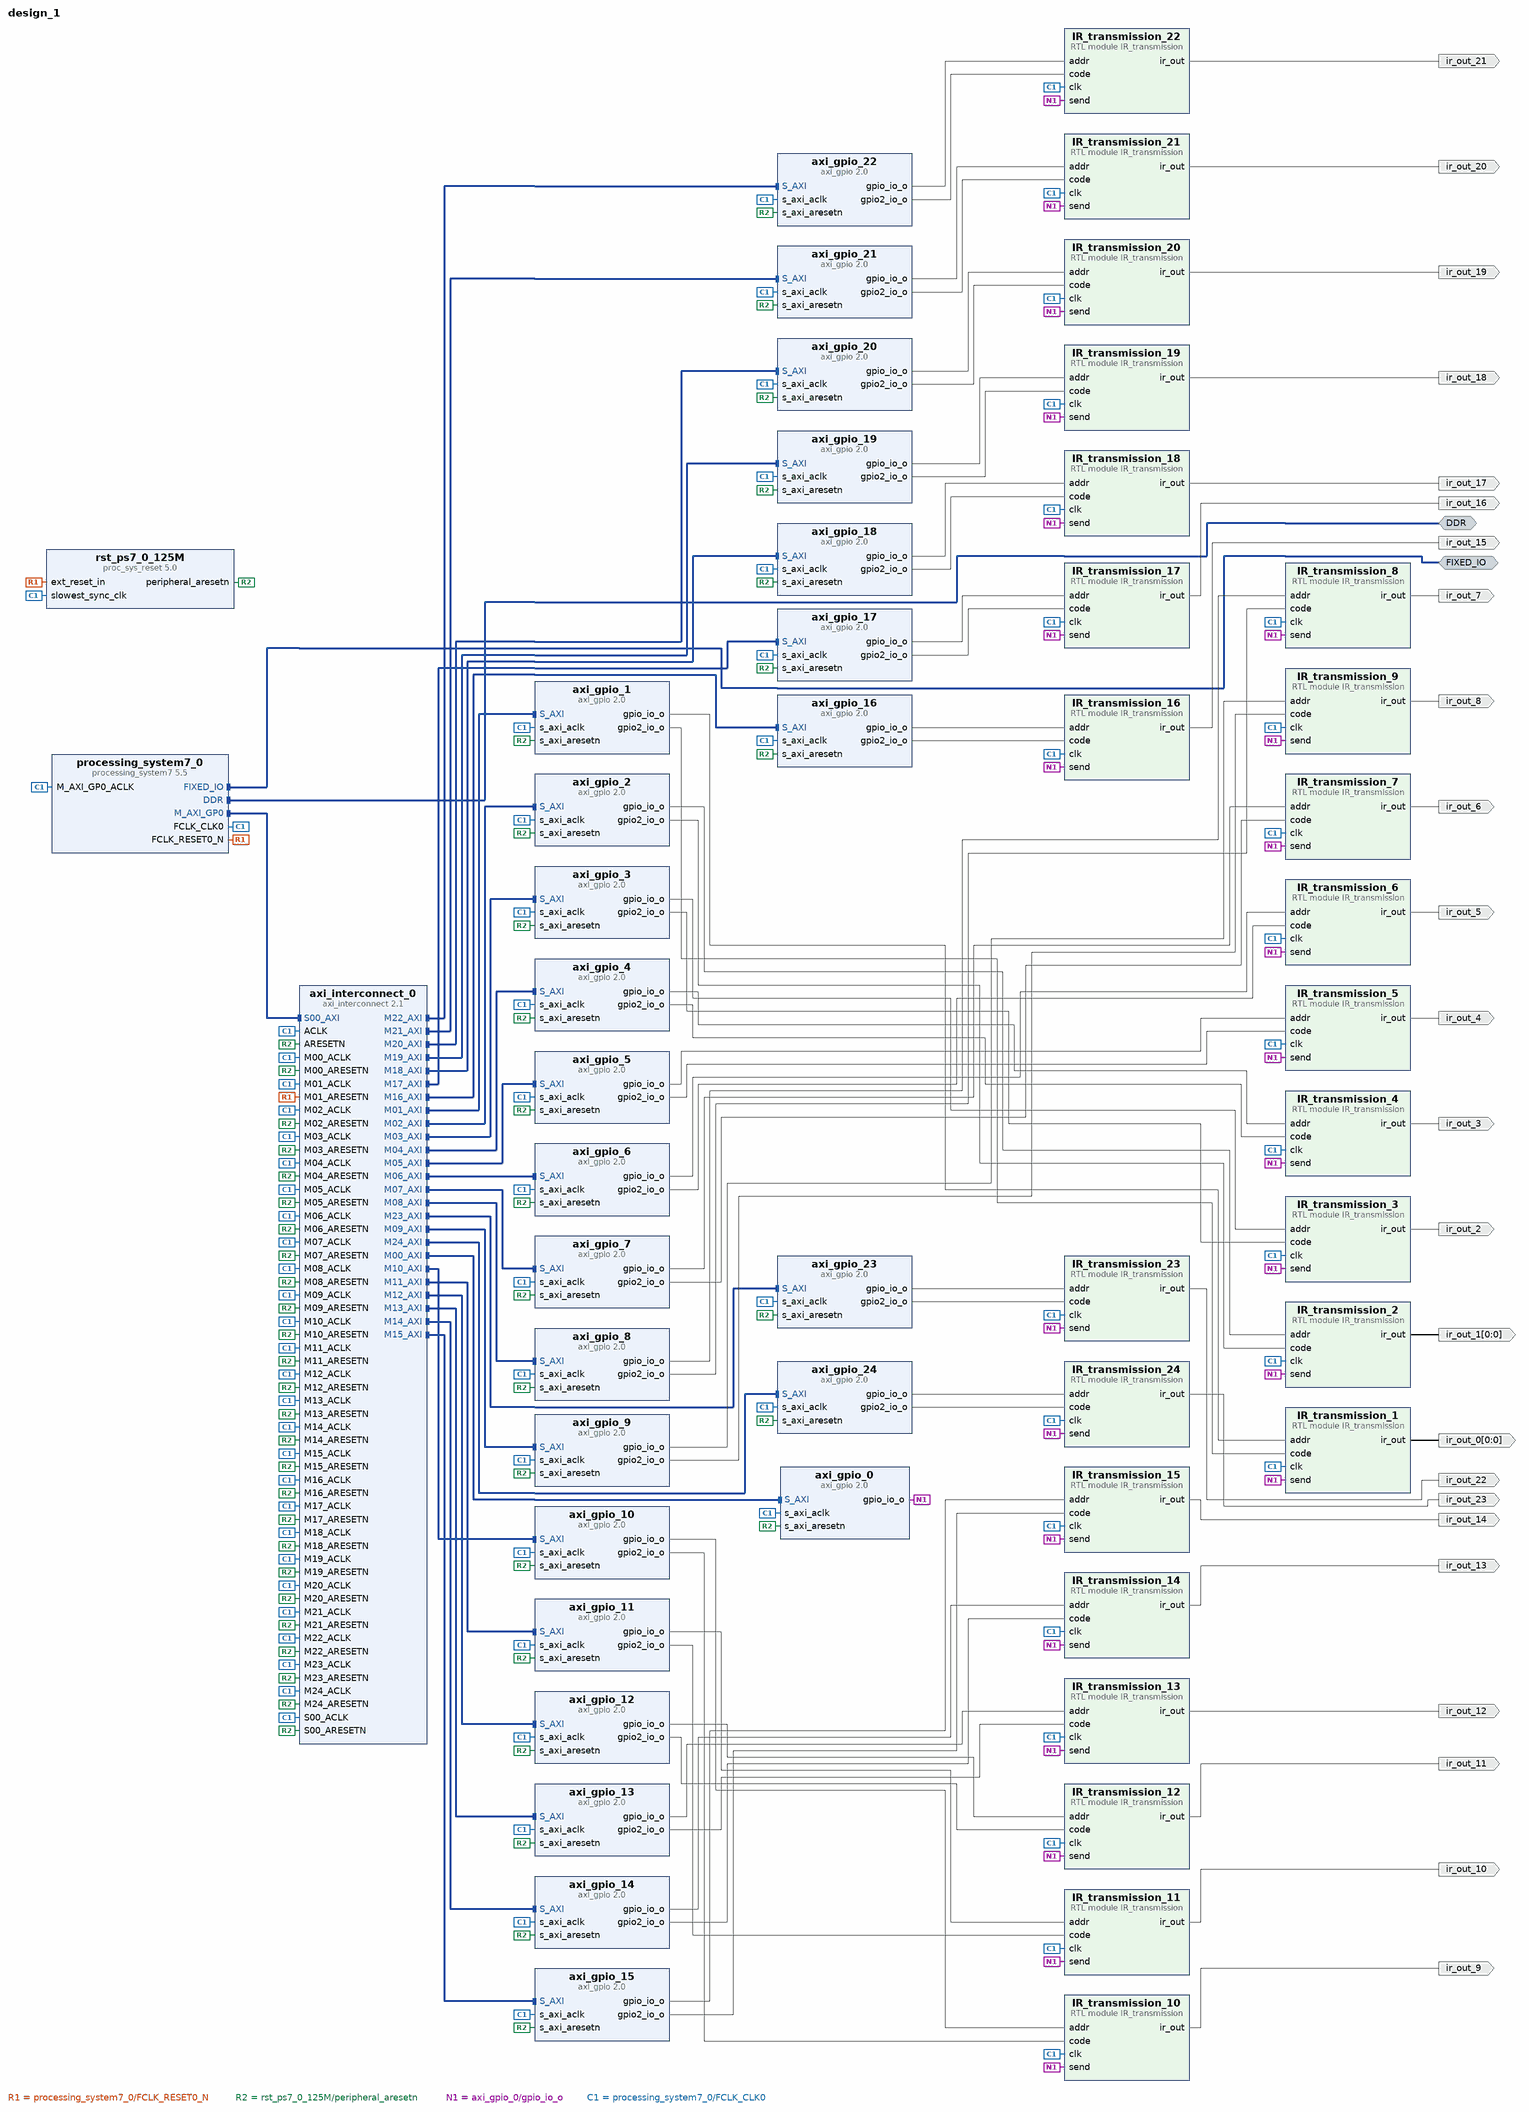
[diagram p0: block diagram of the top level]
# Vivado block design design_1, xc7z020clg400-1, Vivado 2020.2
create_bd_design design_1

create_bd_intf_port -mode Master -vlnv xilinx.com:interface:ddrx_rtl:1.0 DDR
create_bd_intf_port -mode Master -vlnv xilinx.com:display_processing_system7:fixedio_rtl:1.0 FIXED_IO
create_bd_port -dir O -from 0 -to 0 ir_out_0
create_bd_port -dir O -from 0 -to 0 ir_out_1
create_bd_port -dir O ir_out_2
create_bd_port -dir O ir_out_3
create_bd_port -dir O ir_out_4
create_bd_port -dir O ir_out_5
create_bd_port -dir O ir_out_6
create_bd_port -dir O ir_out_7
create_bd_port -dir O ir_out_8
create_bd_port -dir O ir_out_9
create_bd_port -dir O ir_out_10
create_bd_port -dir O ir_out_11
create_bd_port -dir O ir_out_12
create_bd_port -dir O ir_out_13
create_bd_port -dir O ir_out_14
create_bd_port -dir O ir_out_15
create_bd_port -dir O ir_out_16
create_bd_port -dir O ir_out_17
create_bd_port -dir O ir_out_18
create_bd_port -dir O ir_out_19
create_bd_port -dir O ir_out_20
create_bd_port -dir O ir_out_21
create_bd_port -dir O ir_out_22
create_bd_port -dir O ir_out_23

create_bd_cell -type ip -vlnv xilinx.com:ip:axi_interconnect:2.1 axi_interconnect_0
set_property -dict {CONFIG.NUM_MI 25} [get_bd_cells axi_interconnect_0]
create_bd_cell -type ip -vlnv xilinx.com:ip:axi_gpio:2.0 axi_gpio_0
set_property -dict {CONFIG.C_ALL_OUTPUTS 1 CONFIG.C_GPIO_WIDTH 1 CONFIG.C_IS_DUAL 0} [get_bd_cells axi_gpio_0]
create_bd_cell -type ip -vlnv xilinx.com:ip:axi_gpio:2.0 axi_gpio_2
set_property -dict [list \
  CONFIG.C_ALL_OUTPUTS 1 \
  CONFIG.C_ALL_OUTPUTS_2 1 \
  CONFIG.C_GPIO2_WIDTH 8 \
  CONFIG.C_GPIO_WIDTH 8 \
  CONFIG.C_IS_DUAL 1 \
] [get_bd_cells axi_gpio_2]
create_bd_cell -type ip -vlnv xilinx.com:ip:axi_gpio:2.0 axi_gpio_1
set_property -dict [list \
  CONFIG.C_ALL_OUTPUTS 1 \
  CONFIG.C_ALL_OUTPUTS_2 1 \
  CONFIG.C_GPIO2_WIDTH 8 \
  CONFIG.C_GPIO_WIDTH 8 \
  CONFIG.C_IS_DUAL 1 \
] [get_bd_cells axi_gpio_1]
create_bd_cell -type ip -vlnv xilinx.com:ip:processing_system7:5.5 processing_system7_0
set_property -dict [list \
  CONFIG.PCW_APU_PERIPHERAL_FREQMHZ 650 \
  CONFIG.PCW_CRYSTAL_PERIPHERAL_FREQMHZ 50 \
  CONFIG.PCW_ENET0_ENET0_IO {MIO 16 .. 27} \
  CONFIG.PCW_ENET0_GRP_MDIO_ENABLE 1 \
  CONFIG.PCW_ENET0_GRP_MDIO_IO {MIO 52 .. 53} \
  CONFIG.PCW_ENET0_PERIPHERAL_ENABLE 1 \
  CONFIG.PCW_ENET0_RESET_ENABLE 1 \
  CONFIG.PCW_ENET0_RESET_IO {MIO 9} \
  CONFIG.PCW_ENET_RESET_ENABLE 1 \
  CONFIG.PCW_ENET_RESET_SELECT {Share reset pin} \
  CONFIG.PCW_FPGA0_PERIPHERAL_FREQMHZ 125 \
  CONFIG.PCW_FPGA1_PERIPHERAL_FREQMHZ 50 \
  CONFIG.PCW_GPIO_MIO_GPIO_ENABLE 1 \
  CONFIG.PCW_GPIO_MIO_GPIO_IO MIO \
  CONFIG.PCW_I2C_RESET_ENABLE 0 \
  CONFIG.PCW_M_AXI_GP0_FREQMHZ 10 \
  CONFIG.PCW_PERIPHERAL_BOARD_PRESET None \
  CONFIG.PCW_PRESET_BANK1_VOLTAGE {LVCMOS 1.8V} \
  CONFIG.PCW_QSPI_GRP_FBCLK_ENABLE 1 \
  CONFIG.PCW_QSPI_GRP_FBCLK_IO {MIO 8} \
  CONFIG.PCW_QSPI_GRP_SINGLE_SS_ENABLE 1 \
  CONFIG.PCW_QSPI_GRP_SINGLE_SS_IO {MIO 1 .. 6} \
  CONFIG.PCW_QSPI_PERIPHERAL_ENABLE 1 \
  CONFIG.PCW_QSPI_QSPI_IO {MIO 1 .. 6} \
  CONFIG.PCW_SD0_GRP_CD_ENABLE 1 \
  CONFIG.PCW_SD0_GRP_CD_IO {MIO 47} \
  CONFIG.PCW_SD0_GRP_WP_ENABLE 0 \
  CONFIG.PCW_SD0_PERIPHERAL_ENABLE 1 \
  CONFIG.PCW_SD0_SD0_IO {MIO 40 .. 45} \
  CONFIG.PCW_SDIO_PERIPHERAL_FREQMHZ 50 \
  CONFIG.PCW_SINGLE_QSPI_DATA_MODE x4 \
  CONFIG.PCW_UART0_PERIPHERAL_ENABLE 1 \
  CONFIG.PCW_UART0_UART0_IO {MIO 14 .. 15} \
  CONFIG.PCW_UART1_PERIPHERAL_ENABLE 0 \
  CONFIG.PCW_UART_PERIPHERAL_FREQMHZ 100 \
  CONFIG.PCW_UIPARAM_DDR_BUS_WIDTH {16 Bit} \
  CONFIG.PCW_UIPARAM_DDR_FREQ_MHZ 525 \
  CONFIG.PCW_UIPARAM_DDR_PARTNO {MT41J256M16 RE-125} \
  CONFIG.PCW_USB0_PERIPHERAL_ENABLE 1 \
  CONFIG.PCW_USB0_RESET_ENABLE 1 \
  CONFIG.PCW_USB0_RESET_IO {MIO 46} \
  CONFIG.PCW_USB0_USB0_IO {MIO 28 .. 39} \
  CONFIG.PCW_USB_RESET_ENABLE 1 \
  CONFIG.PCW_USB_RESET_SELECT {Share reset pin} \
  CONFIG.preset None \
] [get_bd_cells processing_system7_0]
# 497 more settings of processing_system7_0 are not shown: defaults, MIO pin electricals, DDR timing, and values the tool derives
create_bd_cell -type ip -vlnv xilinx.com:ip:proc_sys_reset:5.0 rst_ps7_0_125M
create_bd_cell -type module -reference IR_transmission IR_transmission_3
set_property -dict {CONFIG.CARRIER_FREQ 42000} [get_bd_cells IR_transmission_3]
create_bd_cell -type ip -vlnv xilinx.com:ip:axi_gpio:2.0 axi_gpio_3
set_property -dict [list \
  CONFIG.C_ALL_OUTPUTS 1 \
  CONFIG.C_ALL_OUTPUTS_2 1 \
  CONFIG.C_GPIO2_WIDTH 8 \
  CONFIG.C_GPIO_WIDTH 8 \
  CONFIG.C_IS_DUAL 1 \
] [get_bd_cells axi_gpio_3]
create_bd_cell -type module -reference IR_transmission IR_transmission_1
create_bd_cell -type module -reference IR_transmission IR_transmission_2
set_property -dict {CONFIG.CARRIER_FREQ 40000} [get_bd_cells IR_transmission_2]
create_bd_cell -type ip -vlnv xilinx.com:ip:axi_gpio:2.0 axi_gpio_4
set_property -dict [list \
  CONFIG.C_ALL_OUTPUTS 1 \
  CONFIG.C_ALL_OUTPUTS_2 1 \
  CONFIG.C_GPIO2_WIDTH 8 \
  CONFIG.C_GPIO_WIDTH 8 \
  CONFIG.C_IS_DUAL 1 \
] [get_bd_cells axi_gpio_4]
create_bd_cell -type ip -vlnv xilinx.com:ip:axi_gpio:2.0 axi_gpio_5
set_property -dict [list \
  CONFIG.C_ALL_OUTPUTS 1 \
  CONFIG.C_ALL_OUTPUTS_2 1 \
  CONFIG.C_GPIO2_WIDTH 8 \
  CONFIG.C_GPIO_WIDTH 8 \
  CONFIG.C_IS_DUAL 1 \
] [get_bd_cells axi_gpio_5]
create_bd_cell -type ip -vlnv xilinx.com:ip:axi_gpio:2.0 axi_gpio_6
set_property -dict [list \
  CONFIG.C_ALL_OUTPUTS 1 \
  CONFIG.C_ALL_OUTPUTS_2 1 \
  CONFIG.C_GPIO2_WIDTH 8 \
  CONFIG.C_GPIO_WIDTH 8 \
  CONFIG.C_IS_DUAL 1 \
] [get_bd_cells axi_gpio_6]
create_bd_cell -type ip -vlnv xilinx.com:ip:axi_gpio:2.0 axi_gpio_7
set_property -dict [list \
  CONFIG.C_ALL_OUTPUTS 1 \
  CONFIG.C_ALL_OUTPUTS_2 1 \
  CONFIG.C_GPIO2_WIDTH 8 \
  CONFIG.C_GPIO_WIDTH 8 \
  CONFIG.C_IS_DUAL 1 \
] [get_bd_cells axi_gpio_7]
create_bd_cell -type module -reference IR_transmission IR_transmission_4
set_property -dict {CONFIG.CARRIER_FREQ 44000} [get_bd_cells IR_transmission_4]
create_bd_cell -type module -reference IR_transmission IR_transmission_5
set_property -dict {CONFIG.CARRIER_FREQ 46000} [get_bd_cells IR_transmission_5]
create_bd_cell -type module -reference IR_transmission IR_transmission_6
set_property -dict {CONFIG.CARRIER_FREQ 48000} [get_bd_cells IR_transmission_6]
create_bd_cell -type module -reference IR_transmission IR_transmission_7
set_property -dict {CONFIG.CARRIER_FREQ 50000} [get_bd_cells IR_transmission_7]
create_bd_cell -type ip -vlnv xilinx.com:ip:axi_gpio:2.0 axi_gpio_8
set_property -dict [list \
  CONFIG.C_ALL_OUTPUTS 1 \
  CONFIG.C_ALL_OUTPUTS_2 1 \
  CONFIG.C_GPIO2_WIDTH 8 \
  CONFIG.C_GPIO_WIDTH 8 \
  CONFIG.C_IS_DUAL 1 \
] [get_bd_cells axi_gpio_8]
create_bd_cell -type ip -vlnv xilinx.com:ip:axi_gpio:2.0 axi_gpio_9
set_property -dict [list \
  CONFIG.C_ALL_OUTPUTS 1 \
  CONFIG.C_ALL_OUTPUTS_2 1 \
  CONFIG.C_GPIO2_WIDTH 8 \
  CONFIG.C_GPIO_WIDTH 8 \
  CONFIG.C_IS_DUAL 1 \
] [get_bd_cells axi_gpio_9]
create_bd_cell -type ip -vlnv xilinx.com:ip:axi_gpio:2.0 axi_gpio_10
set_property -dict [list \
  CONFIG.C_ALL_OUTPUTS 1 \
  CONFIG.C_ALL_OUTPUTS_2 1 \
  CONFIG.C_GPIO2_WIDTH 8 \
  CONFIG.C_GPIO_WIDTH 8 \
  CONFIG.C_IS_DUAL 1 \
] [get_bd_cells axi_gpio_10]
create_bd_cell -type ip -vlnv xilinx.com:ip:axi_gpio:2.0 axi_gpio_11
set_property -dict [list \
  CONFIG.C_ALL_OUTPUTS 1 \
  CONFIG.C_ALL_OUTPUTS_2 1 \
  CONFIG.C_GPIO2_WIDTH 8 \
  CONFIG.C_GPIO_WIDTH 8 \
  CONFIG.C_IS_DUAL 1 \
] [get_bd_cells axi_gpio_11]
create_bd_cell -type ip -vlnv xilinx.com:ip:axi_gpio:2.0 axi_gpio_12
set_property -dict [list \
  CONFIG.C_ALL_OUTPUTS 1 \
  CONFIG.C_ALL_OUTPUTS_2 1 \
  CONFIG.C_GPIO2_WIDTH 8 \
  CONFIG.C_GPIO_WIDTH 8 \
  CONFIG.C_IS_DUAL 1 \
] [get_bd_cells axi_gpio_12]
create_bd_cell -type ip -vlnv xilinx.com:ip:axi_gpio:2.0 axi_gpio_13
set_property -dict [list \
  CONFIG.C_ALL_OUTPUTS 1 \
  CONFIG.C_ALL_OUTPUTS_2 1 \
  CONFIG.C_GPIO2_WIDTH 8 \
  CONFIG.C_GPIO_WIDTH 8 \
  CONFIG.C_IS_DUAL 1 \
] [get_bd_cells axi_gpio_13]
create_bd_cell -type ip -vlnv xilinx.com:ip:axi_gpio:2.0 axi_gpio_14
set_property -dict [list \
  CONFIG.C_ALL_OUTPUTS 1 \
  CONFIG.C_ALL_OUTPUTS_2 1 \
  CONFIG.C_GPIO2_WIDTH 8 \
  CONFIG.C_GPIO_WIDTH 8 \
  CONFIG.C_IS_DUAL 1 \
] [get_bd_cells axi_gpio_14]
create_bd_cell -type module -reference IR_transmission IR_transmission_8
set_property -dict {CONFIG.CARRIER_FREQ 52000} [get_bd_cells IR_transmission_8]
create_bd_cell -type module -reference IR_transmission IR_transmission_9
set_property -dict {CONFIG.CARRIER_FREQ 54000} [get_bd_cells IR_transmission_9]
create_bd_cell -type module -reference IR_transmission IR_transmission_10
set_property -dict {CONFIG.CARRIER_FREQ 56000} [get_bd_cells IR_transmission_10]
create_bd_cell -type module -reference IR_transmission IR_transmission_11
set_property -dict {CONFIG.CARRIER_FREQ 58000} [get_bd_cells IR_transmission_11]
create_bd_cell -type module -reference IR_transmission IR_transmission_12
set_property -dict {CONFIG.CARRIER_FREQ 60000} [get_bd_cells IR_transmission_12]
create_bd_cell -type module -reference IR_transmission IR_transmission_13
set_property -dict {CONFIG.CARRIER_FREQ 62000} [get_bd_cells IR_transmission_13]
create_bd_cell -type module -reference IR_transmission IR_transmission_14
set_property -dict {CONFIG.CARRIER_FREQ 64000} [get_bd_cells IR_transmission_14]
create_bd_cell -type ip -vlnv xilinx.com:ip:axi_gpio:2.0 axi_gpio_15
set_property -dict [list \
  CONFIG.C_ALL_OUTPUTS 1 \
  CONFIG.C_ALL_OUTPUTS_2 1 \
  CONFIG.C_GPIO2_WIDTH 8 \
  CONFIG.C_GPIO_WIDTH 8 \
  CONFIG.C_IS_DUAL 1 \
] [get_bd_cells axi_gpio_15]
create_bd_cell -type ip -vlnv xilinx.com:ip:axi_gpio:2.0 axi_gpio_16
set_property -dict [list \
  CONFIG.C_ALL_OUTPUTS 1 \
  CONFIG.C_ALL_OUTPUTS_2 1 \
  CONFIG.C_GPIO2_WIDTH 8 \
  CONFIG.C_GPIO_WIDTH 8 \
  CONFIG.C_IS_DUAL 1 \
] [get_bd_cells axi_gpio_16]
create_bd_cell -type ip -vlnv xilinx.com:ip:axi_gpio:2.0 axi_gpio_17
set_property -dict [list \
  CONFIG.C_ALL_OUTPUTS 1 \
  CONFIG.C_ALL_OUTPUTS_2 1 \
  CONFIG.C_GPIO2_WIDTH 8 \
  CONFIG.C_GPIO_WIDTH 8 \
  CONFIG.C_IS_DUAL 1 \
] [get_bd_cells axi_gpio_17]
create_bd_cell -type ip -vlnv xilinx.com:ip:axi_gpio:2.0 axi_gpio_18
set_property -dict [list \
  CONFIG.C_ALL_OUTPUTS 1 \
  CONFIG.C_ALL_OUTPUTS_2 1 \
  CONFIG.C_GPIO2_WIDTH 8 \
  CONFIG.C_GPIO_WIDTH 8 \
  CONFIG.C_IS_DUAL 1 \
] [get_bd_cells axi_gpio_18]
create_bd_cell -type ip -vlnv xilinx.com:ip:axi_gpio:2.0 axi_gpio_19
set_property -dict [list \
  CONFIG.C_ALL_OUTPUTS 1 \
  CONFIG.C_ALL_OUTPUTS_2 1 \
  CONFIG.C_GPIO2_WIDTH 8 \
  CONFIG.C_GPIO_WIDTH 8 \
  CONFIG.C_IS_DUAL 1 \
] [get_bd_cells axi_gpio_19]
create_bd_cell -type ip -vlnv xilinx.com:ip:axi_gpio:2.0 axi_gpio_20
set_property -dict [list \
  CONFIG.C_ALL_OUTPUTS 1 \
  CONFIG.C_ALL_OUTPUTS_2 1 \
  CONFIG.C_GPIO2_WIDTH 8 \
  CONFIG.C_GPIO_WIDTH 8 \
  CONFIG.C_IS_DUAL 1 \
] [get_bd_cells axi_gpio_20]
create_bd_cell -type ip -vlnv xilinx.com:ip:axi_gpio:2.0 axi_gpio_21
set_property -dict [list \
  CONFIG.C_ALL_OUTPUTS 1 \
  CONFIG.C_ALL_OUTPUTS_2 1 \
  CONFIG.C_GPIO2_WIDTH 8 \
  CONFIG.C_GPIO_WIDTH 8 \
  CONFIG.C_IS_DUAL 1 \
] [get_bd_cells axi_gpio_21]
create_bd_cell -type ip -vlnv xilinx.com:ip:axi_gpio:2.0 axi_gpio_22
set_property -dict [list \
  CONFIG.C_ALL_OUTPUTS 1 \
  CONFIG.C_ALL_OUTPUTS_2 1 \
  CONFIG.C_GPIO2_WIDTH 8 \
  CONFIG.C_GPIO_WIDTH 8 \
  CONFIG.C_IS_DUAL 1 \
] [get_bd_cells axi_gpio_22]
create_bd_cell -type ip -vlnv xilinx.com:ip:axi_gpio:2.0 axi_gpio_23
set_property -dict [list \
  CONFIG.C_ALL_OUTPUTS 1 \
  CONFIG.C_ALL_OUTPUTS_2 1 \
  CONFIG.C_GPIO2_WIDTH 8 \
  CONFIG.C_GPIO_WIDTH 8 \
  CONFIG.C_IS_DUAL 1 \
] [get_bd_cells axi_gpio_23]
create_bd_cell -type ip -vlnv xilinx.com:ip:axi_gpio:2.0 axi_gpio_24
set_property -dict [list \
  CONFIG.C_ALL_OUTPUTS 1 \
  CONFIG.C_ALL_OUTPUTS_2 1 \
  CONFIG.C_GPIO2_WIDTH 8 \
  CONFIG.C_GPIO_WIDTH 8 \
  CONFIG.C_IS_DUAL 1 \
] [get_bd_cells axi_gpio_24]
create_bd_cell -type module -reference IR_transmission IR_transmission_15
set_property -dict {CONFIG.CARRIER_FREQ 66000} [get_bd_cells IR_transmission_15]
create_bd_cell -type module -reference IR_transmission IR_transmission_16
set_property -dict {CONFIG.CARRIER_FREQ 68000} [get_bd_cells IR_transmission_16]
create_bd_cell -type module -reference IR_transmission IR_transmission_17
set_property -dict {CONFIG.CARRIER_FREQ 70000} [get_bd_cells IR_transmission_17]
create_bd_cell -type module -reference IR_transmission IR_transmission_18
set_property -dict {CONFIG.CARRIER_FREQ 72000} [get_bd_cells IR_transmission_18]
create_bd_cell -type module -reference IR_transmission IR_transmission_19
set_property -dict {CONFIG.CARRIER_FREQ 74000} [get_bd_cells IR_transmission_19]
create_bd_cell -type module -reference IR_transmission IR_transmission_20
set_property -dict {CONFIG.CARRIER_FREQ 76000} [get_bd_cells IR_transmission_20]
create_bd_cell -type module -reference IR_transmission IR_transmission_21
set_property -dict {CONFIG.CARRIER_FREQ 78000} [get_bd_cells IR_transmission_21]
create_bd_cell -type module -reference IR_transmission IR_transmission_22
set_property -dict {CONFIG.CARRIER_FREQ 80000} [get_bd_cells IR_transmission_22]
create_bd_cell -type module -reference IR_transmission IR_transmission_23
set_property -dict {CONFIG.CARRIER_FREQ 82000} [get_bd_cells IR_transmission_23]
create_bd_cell -type module -reference IR_transmission IR_transmission_24
set_property -dict {CONFIG.CARRIER_FREQ 84000} [get_bd_cells IR_transmission_24]

# ---- connections ----

connect_bd_intf_net [get_bd_intf_pins axi_interconnect_0/M12_AXI] [get_bd_intf_pins axi_gpio_12/S_AXI]
connect_bd_intf_net [get_bd_intf_pins axi_interconnect_0/M21_AXI] [get_bd_intf_pins axi_gpio_21/S_AXI]
connect_bd_intf_net [get_bd_intf_pins axi_interconnect_0/M20_AXI] [get_bd_intf_pins axi_gpio_20/S_AXI]
connect_bd_intf_net [get_bd_intf_pins axi_interconnect_0/M22_AXI] [get_bd_intf_pins axi_gpio_22/S_AXI]
connect_bd_intf_net [get_bd_intf_pins axi_interconnect_0/M07_AXI] [get_bd_intf_pins axi_gpio_7/S_AXI]
connect_bd_intf_net [get_bd_intf_pins axi_interconnect_0/M00_AXI] [get_bd_intf_pins axi_gpio_0/S_AXI]
connect_bd_intf_net [get_bd_intf_pins axi_interconnect_0/M13_AXI] [get_bd_intf_pins axi_gpio_13/S_AXI]
connect_bd_intf_net [get_bd_intf_ports FIXED_IO] [get_bd_intf_pins processing_system7_0/FIXED_IO]
connect_bd_intf_net [get_bd_intf_pins axi_interconnect_0/M16_AXI] [get_bd_intf_pins axi_gpio_16/S_AXI]
connect_bd_intf_net [get_bd_intf_pins axi_interconnect_0/M04_AXI] [get_bd_intf_pins axi_gpio_4/S_AXI]
connect_bd_intf_net [get_bd_intf_pins axi_interconnect_0/M11_AXI] [get_bd_intf_pins axi_gpio_11/S_AXI]
connect_bd_intf_net [get_bd_intf_pins axi_interconnect_0/M03_AXI] [get_bd_intf_pins axi_gpio_3/S_AXI]
connect_bd_intf_net [get_bd_intf_pins axi_interconnect_0/M09_AXI] [get_bd_intf_pins axi_gpio_9/S_AXI]
connect_bd_intf_net [get_bd_intf_pins axi_interconnect_0/M17_AXI] [get_bd_intf_pins axi_gpio_17/S_AXI]
connect_bd_intf_net [get_bd_intf_pins axi_interconnect_0/M15_AXI] [get_bd_intf_pins axi_gpio_15/S_AXI]
connect_bd_intf_net [get_bd_intf_pins axi_interconnect_0/M18_AXI] [get_bd_intf_pins axi_gpio_18/S_AXI]
connect_bd_intf_net [get_bd_intf_pins axi_interconnect_0/M10_AXI] [get_bd_intf_pins axi_gpio_10/S_AXI]
connect_bd_intf_net [get_bd_intf_pins axi_interconnect_0/M05_AXI] [get_bd_intf_pins axi_gpio_5/S_AXI]
connect_bd_intf_net [get_bd_intf_pins axi_interconnect_0/M19_AXI] [get_bd_intf_pins axi_gpio_19/S_AXI]
connect_bd_intf_net [get_bd_intf_pins axi_interconnect_0/M24_AXI] [get_bd_intf_pins axi_gpio_24/S_AXI]
connect_bd_intf_net [get_bd_intf_pins axi_interconnect_0/M14_AXI] [get_bd_intf_pins axi_gpio_14/S_AXI]
connect_bd_intf_net [get_bd_intf_pins axi_interconnect_0/M08_AXI] [get_bd_intf_pins axi_gpio_8/S_AXI]
connect_bd_intf_net [get_bd_intf_pins axi_interconnect_0/M23_AXI] [get_bd_intf_pins axi_gpio_23/S_AXI]
connect_bd_intf_net [get_bd_intf_pins axi_interconnect_0/M06_AXI] [get_bd_intf_pins axi_gpio_6/S_AXI]
connect_bd_intf_net [get_bd_intf_pins axi_interconnect_0/M01_AXI] [get_bd_intf_pins axi_gpio_1/S_AXI]
connect_bd_intf_net [get_bd_intf_pins processing_system7_0/M_AXI_GP0] [get_bd_intf_pins axi_interconnect_0/S00_AXI]
connect_bd_intf_net [get_bd_intf_ports DDR] [get_bd_intf_pins processing_system7_0/DDR]
connect_bd_intf_net [get_bd_intf_pins axi_interconnect_0/M02_AXI] [get_bd_intf_pins axi_gpio_2/S_AXI]
connect_bd_net [get_bd_pins processing_system7_0/FCLK_RESET0_N] [get_bd_pins axi_interconnect_0/M01_ARESETN] [get_bd_pins rst_ps7_0_125M/ext_reset_in]
connect_bd_net [get_bd_pins rst_ps7_0_125M/peripheral_aresetn] \
  [get_bd_pins axi_interconnect_0/ARESETN] [get_bd_pins axi_interconnect_0/S00_ARESETN] \
  [get_bd_pins axi_interconnect_0/M00_ARESETN] [get_bd_pins axi_interconnect_0/M02_ARESETN] \
  [get_bd_pins axi_gpio_0/s_axi_aresetn] [get_bd_pins axi_gpio_2/s_axi_aresetn] [get_bd_pins axi_gpio_1/s_axi_aresetn] \
  [get_bd_pins axi_gpio_3/s_axi_aresetn] [get_bd_pins axi_interconnect_0/M03_ARESETN] [get_bd_pins axi_gpio_4/s_axi_aresetn] \
  [get_bd_pins axi_interconnect_0/M04_ARESETN] [get_bd_pins axi_gpio_5/s_axi_aresetn] \
  [get_bd_pins axi_interconnect_0/M05_ARESETN] [get_bd_pins axi_gpio_6/s_axi_aresetn] \
  [get_bd_pins axi_interconnect_0/M06_ARESETN] [get_bd_pins axi_gpio_7/s_axi_aresetn] \
  [get_bd_pins axi_interconnect_0/M07_ARESETN] [get_bd_pins axi_gpio_8/s_axi_aresetn] \
  [get_bd_pins axi_interconnect_0/M08_ARESETN] [get_bd_pins axi_gpio_9/s_axi_aresetn] \
  [get_bd_pins axi_interconnect_0/M09_ARESETN] [get_bd_pins axi_gpio_10/s_axi_aresetn] \
  [get_bd_pins axi_interconnect_0/M10_ARESETN] [get_bd_pins axi_gpio_11/s_axi_aresetn] \
  [get_bd_pins axi_interconnect_0/M11_ARESETN] [get_bd_pins axi_gpio_12/s_axi_aresetn] \
  [get_bd_pins axi_interconnect_0/M12_ARESETN] [get_bd_pins axi_gpio_13/s_axi_aresetn] \
  [get_bd_pins axi_interconnect_0/M13_ARESETN] [get_bd_pins axi_gpio_14/s_axi_aresetn] \
  [get_bd_pins axi_interconnect_0/M14_ARESETN] [get_bd_pins axi_gpio_15/s_axi_aresetn] \
  [get_bd_pins axi_interconnect_0/M15_ARESETN] [get_bd_pins axi_gpio_16/s_axi_aresetn] \
  [get_bd_pins axi_interconnect_0/M16_ARESETN] [get_bd_pins axi_gpio_17/s_axi_aresetn] \
  [get_bd_pins axi_interconnect_0/M17_ARESETN] [get_bd_pins axi_gpio_18/s_axi_aresetn] \
  [get_bd_pins axi_interconnect_0/M18_ARESETN] [get_bd_pins axi_gpio_19/s_axi_aresetn] \
  [get_bd_pins axi_interconnect_0/M19_ARESETN] [get_bd_pins axi_gpio_20/s_axi_aresetn] \
  [get_bd_pins axi_interconnect_0/M20_ARESETN] [get_bd_pins axi_gpio_21/s_axi_aresetn] \
  [get_bd_pins axi_interconnect_0/M21_ARESETN] [get_bd_pins axi_gpio_22/s_axi_aresetn] \
  [get_bd_pins axi_interconnect_0/M22_ARESETN] [get_bd_pins axi_gpio_23/s_axi_aresetn] \
  [get_bd_pins axi_interconnect_0/M23_ARESETN] [get_bd_pins axi_gpio_24/s_axi_aresetn] \
  [get_bd_pins axi_interconnect_0/M24_ARESETN]
connect_bd_net [get_bd_pins IR_transmission_1/ir_out] [get_bd_ports ir_out_0]
connect_bd_net [get_bd_pins IR_transmission_2/ir_out] [get_bd_ports ir_out_1]
connect_bd_net [get_bd_pins axi_gpio_1/gpio_io_o] [get_bd_pins IR_transmission_1/addr]
connect_bd_net [get_bd_pins axi_gpio_1/gpio2_io_o] [get_bd_pins IR_transmission_1/code]
connect_bd_net [get_bd_pins axi_gpio_2/gpio_io_o] [get_bd_pins IR_transmission_2/addr]
connect_bd_net [get_bd_pins axi_gpio_2/gpio2_io_o] [get_bd_pins IR_transmission_2/code]
connect_bd_net [get_bd_pins axi_gpio_0/gpio_io_o] \
  [get_bd_pins IR_transmission_3/send] [get_bd_pins IR_transmission_1/send] [get_bd_pins IR_transmission_2/send] \
  [get_bd_pins IR_transmission_4/send] [get_bd_pins IR_transmission_5/send] [get_bd_pins IR_transmission_6/send] \
  [get_bd_pins IR_transmission_7/send] [get_bd_pins IR_transmission_8/send] [get_bd_pins IR_transmission_9/send] \
  [get_bd_pins IR_transmission_10/send] [get_bd_pins IR_transmission_11/send] [get_bd_pins IR_transmission_12/send] \
  [get_bd_pins IR_transmission_13/send] [get_bd_pins IR_transmission_14/send] [get_bd_pins IR_transmission_15/send] \
  [get_bd_pins IR_transmission_16/send] [get_bd_pins IR_transmission_17/send] [get_bd_pins IR_transmission_18/send] \
  [get_bd_pins IR_transmission_19/send] [get_bd_pins IR_transmission_20/send] [get_bd_pins IR_transmission_21/send] \
  [get_bd_pins IR_transmission_22/send] [get_bd_pins IR_transmission_23/send] [get_bd_pins IR_transmission_24/send]
connect_bd_net [get_bd_pins processing_system7_0/FCLK_CLK0] \
  [get_bd_pins axi_interconnect_0/M00_ACLK] [get_bd_pins axi_interconnect_0/M01_ACLK] \
  [get_bd_pins axi_interconnect_0/M02_ACLK] [get_bd_pins axi_interconnect_0/ACLK] [get_bd_pins axi_interconnect_0/S00_ACLK] \
  [get_bd_pins axi_gpio_0/s_axi_aclk] [get_bd_pins axi_gpio_2/s_axi_aclk] [get_bd_pins axi_gpio_1/s_axi_aclk] \
  [get_bd_pins processing_system7_0/M_AXI_GP0_ACLK] [get_bd_pins rst_ps7_0_125M/slowest_sync_clk] \
  [get_bd_pins axi_gpio_3/s_axi_aclk] [get_bd_pins axi_interconnect_0/M03_ACLK] [get_bd_pins IR_transmission_3/clk] \
  [get_bd_pins IR_transmission_1/clk] [get_bd_pins IR_transmission_2/clk] [get_bd_pins axi_gpio_4/s_axi_aclk] \
  [get_bd_pins axi_interconnect_0/M04_ACLK] [get_bd_pins axi_gpio_5/s_axi_aclk] [get_bd_pins axi_interconnect_0/M05_ACLK] \
  [get_bd_pins axi_gpio_6/s_axi_aclk] [get_bd_pins axi_interconnect_0/M06_ACLK] [get_bd_pins axi_gpio_7/s_axi_aclk] \
  [get_bd_pins axi_interconnect_0/M07_ACLK] [get_bd_pins IR_transmission_4/clk] [get_bd_pins IR_transmission_5/clk] \
  [get_bd_pins IR_transmission_6/clk] [get_bd_pins IR_transmission_7/clk] [get_bd_pins axi_gpio_8/s_axi_aclk] \
  [get_bd_pins axi_interconnect_0/M08_ACLK] [get_bd_pins axi_gpio_9/s_axi_aclk] [get_bd_pins axi_interconnect_0/M09_ACLK] \
  [get_bd_pins axi_gpio_10/s_axi_aclk] [get_bd_pins axi_interconnect_0/M10_ACLK] [get_bd_pins axi_gpio_11/s_axi_aclk] \
  [get_bd_pins axi_interconnect_0/M11_ACLK] [get_bd_pins axi_gpio_12/s_axi_aclk] [get_bd_pins axi_interconnect_0/M12_ACLK] \
  [get_bd_pins axi_gpio_13/s_axi_aclk] [get_bd_pins axi_interconnect_0/M13_ACLK] [get_bd_pins axi_gpio_14/s_axi_aclk] \
  [get_bd_pins axi_interconnect_0/M14_ACLK] [get_bd_pins IR_transmission_8/clk] [get_bd_pins IR_transmission_9/clk] \
  [get_bd_pins IR_transmission_10/clk] [get_bd_pins IR_transmission_11/clk] [get_bd_pins IR_transmission_12/clk] \
  [get_bd_pins IR_transmission_13/clk] [get_bd_pins IR_transmission_14/clk] [get_bd_pins axi_gpio_15/s_axi_aclk] \
  [get_bd_pins axi_interconnect_0/M15_ACLK] [get_bd_pins axi_gpio_16/s_axi_aclk] [get_bd_pins axi_interconnect_0/M16_ACLK] \
  [get_bd_pins axi_gpio_17/s_axi_aclk] [get_bd_pins axi_interconnect_0/M17_ACLK] [get_bd_pins axi_gpio_18/s_axi_aclk] \
  [get_bd_pins axi_interconnect_0/M18_ACLK] [get_bd_pins axi_gpio_19/s_axi_aclk] [get_bd_pins axi_interconnect_0/M19_ACLK] \
  [get_bd_pins axi_gpio_20/s_axi_aclk] [get_bd_pins axi_interconnect_0/M20_ACLK] [get_bd_pins axi_gpio_21/s_axi_aclk] \
  [get_bd_pins axi_interconnect_0/M21_ACLK] [get_bd_pins axi_gpio_22/s_axi_aclk] [get_bd_pins axi_interconnect_0/M22_ACLK] \
  [get_bd_pins axi_gpio_23/s_axi_aclk] [get_bd_pins axi_interconnect_0/M23_ACLK] [get_bd_pins axi_gpio_24/s_axi_aclk] \
  [get_bd_pins axi_interconnect_0/M24_ACLK] [get_bd_pins IR_transmission_15/clk] [get_bd_pins IR_transmission_16/clk] \
  [get_bd_pins IR_transmission_17/clk] [get_bd_pins IR_transmission_18/clk] [get_bd_pins IR_transmission_19/clk] \
  [get_bd_pins IR_transmission_20/clk] [get_bd_pins IR_transmission_21/clk] [get_bd_pins IR_transmission_22/clk] \
  [get_bd_pins IR_transmission_23/clk] [get_bd_pins IR_transmission_24/clk]
connect_bd_net [get_bd_pins axi_gpio_3/gpio_io_o] [get_bd_pins IR_transmission_3/addr]
connect_bd_net [get_bd_pins axi_gpio_3/gpio2_io_o] [get_bd_pins IR_transmission_3/code]
connect_bd_net [get_bd_pins IR_transmission_3/ir_out] [get_bd_ports ir_out_2]
connect_bd_net [get_bd_pins axi_gpio_4/gpio_io_o] [get_bd_pins IR_transmission_4/addr]
connect_bd_net [get_bd_pins axi_gpio_4/gpio2_io_o] [get_bd_pins IR_transmission_4/code]
connect_bd_net [get_bd_pins axi_gpio_5/gpio_io_o] [get_bd_pins IR_transmission_5/addr]
connect_bd_net [get_bd_pins axi_gpio_5/gpio2_io_o] [get_bd_pins IR_transmission_5/code]
connect_bd_net [get_bd_pins axi_gpio_6/gpio_io_o] [get_bd_pins IR_transmission_6/addr]
connect_bd_net [get_bd_pins axi_gpio_6/gpio2_io_o] [get_bd_pins IR_transmission_6/code]
connect_bd_net [get_bd_pins axi_gpio_7/gpio_io_o] [get_bd_pins IR_transmission_7/addr]
connect_bd_net [get_bd_pins axi_gpio_7/gpio2_io_o] [get_bd_pins IR_transmission_7/code]
connect_bd_net [get_bd_pins IR_transmission_4/ir_out] [get_bd_ports ir_out_3]
connect_bd_net [get_bd_pins IR_transmission_5/ir_out] [get_bd_ports ir_out_4]
connect_bd_net [get_bd_pins IR_transmission_6/ir_out] [get_bd_ports ir_out_5]
connect_bd_net [get_bd_pins IR_transmission_7/ir_out] [get_bd_ports ir_out_6]
connect_bd_net [get_bd_pins axi_gpio_8/gpio_io_o] [get_bd_pins IR_transmission_8/addr]
connect_bd_net [get_bd_pins axi_gpio_8/gpio2_io_o] [get_bd_pins IR_transmission_8/code]
connect_bd_net [get_bd_pins axi_gpio_9/gpio_io_o] [get_bd_pins IR_transmission_9/addr]
connect_bd_net [get_bd_pins axi_gpio_9/gpio2_io_o] [get_bd_pins IR_transmission_9/code]
connect_bd_net [get_bd_pins axi_gpio_10/gpio_io_o] [get_bd_pins IR_transmission_10/addr]
connect_bd_net [get_bd_pins axi_gpio_10/gpio2_io_o] [get_bd_pins IR_transmission_10/code]
connect_bd_net [get_bd_pins axi_gpio_11/gpio_io_o] [get_bd_pins IR_transmission_11/addr]
connect_bd_net [get_bd_pins axi_gpio_11/gpio2_io_o] [get_bd_pins IR_transmission_11/code]
connect_bd_net [get_bd_pins axi_gpio_12/gpio_io_o] [get_bd_pins IR_transmission_12/addr]
connect_bd_net [get_bd_pins axi_gpio_12/gpio2_io_o] [get_bd_pins IR_transmission_12/code]
connect_bd_net [get_bd_pins axi_gpio_13/gpio_io_o] [get_bd_pins IR_transmission_13/addr]
connect_bd_net [get_bd_pins axi_gpio_13/gpio2_io_o] [get_bd_pins IR_transmission_13/code]
connect_bd_net [get_bd_pins axi_gpio_14/gpio_io_o] [get_bd_pins IR_transmission_14/addr]
connect_bd_net [get_bd_pins axi_gpio_14/gpio2_io_o] [get_bd_pins IR_transmission_14/code]
connect_bd_net [get_bd_pins IR_transmission_8/ir_out] [get_bd_ports ir_out_7]
connect_bd_net [get_bd_pins IR_transmission_9/ir_out] [get_bd_ports ir_out_8]
connect_bd_net [get_bd_pins IR_transmission_10/ir_out] [get_bd_ports ir_out_9]
connect_bd_net [get_bd_pins IR_transmission_11/ir_out] [get_bd_ports ir_out_10]
connect_bd_net [get_bd_pins IR_transmission_12/ir_out] [get_bd_ports ir_out_11]
connect_bd_net [get_bd_pins IR_transmission_13/ir_out] [get_bd_ports ir_out_12]
connect_bd_net [get_bd_pins IR_transmission_14/ir_out] [get_bd_ports ir_out_13]
connect_bd_net [get_bd_pins axi_gpio_15/gpio_io_o] [get_bd_pins IR_transmission_15/addr]
connect_bd_net [get_bd_pins axi_gpio_15/gpio2_io_o] [get_bd_pins IR_transmission_15/code]
connect_bd_net [get_bd_pins axi_gpio_16/gpio_io_o] [get_bd_pins IR_transmission_16/addr]
connect_bd_net [get_bd_pins axi_gpio_16/gpio2_io_o] [get_bd_pins IR_transmission_16/code]
connect_bd_net [get_bd_pins axi_gpio_17/gpio_io_o] [get_bd_pins IR_transmission_17/addr]
connect_bd_net [get_bd_pins axi_gpio_17/gpio2_io_o] [get_bd_pins IR_transmission_17/code]
connect_bd_net [get_bd_pins axi_gpio_18/gpio_io_o] [get_bd_pins IR_transmission_18/addr]
connect_bd_net [get_bd_pins axi_gpio_18/gpio2_io_o] [get_bd_pins IR_transmission_18/code]
connect_bd_net [get_bd_pins axi_gpio_19/gpio_io_o] [get_bd_pins IR_transmission_19/addr]
connect_bd_net [get_bd_pins axi_gpio_19/gpio2_io_o] [get_bd_pins IR_transmission_19/code]
connect_bd_net [get_bd_pins axi_gpio_20/gpio_io_o] [get_bd_pins IR_transmission_20/addr]
connect_bd_net [get_bd_pins axi_gpio_20/gpio2_io_o] [get_bd_pins IR_transmission_20/code]
connect_bd_net [get_bd_pins axi_gpio_21/gpio_io_o] [get_bd_pins IR_transmission_21/addr]
connect_bd_net [get_bd_pins axi_gpio_21/gpio2_io_o] [get_bd_pins IR_transmission_21/code]
connect_bd_net [get_bd_pins axi_gpio_22/gpio_io_o] [get_bd_pins IR_transmission_22/addr]
connect_bd_net [get_bd_pins axi_gpio_22/gpio2_io_o] [get_bd_pins IR_transmission_22/code]
connect_bd_net [get_bd_pins axi_gpio_23/gpio_io_o] [get_bd_pins IR_transmission_23/addr]
connect_bd_net [get_bd_pins axi_gpio_23/gpio2_io_o] [get_bd_pins IR_transmission_23/code]
connect_bd_net [get_bd_pins axi_gpio_24/gpio_io_o] [get_bd_pins IR_transmission_24/addr]
connect_bd_net [get_bd_pins axi_gpio_24/gpio2_io_o] [get_bd_pins IR_transmission_24/code]
connect_bd_net [get_bd_pins IR_transmission_15/ir_out] [get_bd_ports ir_out_14]
connect_bd_net [get_bd_pins IR_transmission_16/ir_out] [get_bd_ports ir_out_15]
connect_bd_net [get_bd_pins IR_transmission_17/ir_out] [get_bd_ports ir_out_16]
connect_bd_net [get_bd_pins IR_transmission_18/ir_out] [get_bd_ports ir_out_17]
connect_bd_net [get_bd_pins IR_transmission_19/ir_out] [get_bd_ports ir_out_18]
connect_bd_net [get_bd_pins IR_transmission_20/ir_out] [get_bd_ports ir_out_19]
connect_bd_net [get_bd_pins IR_transmission_21/ir_out] [get_bd_ports ir_out_20]
connect_bd_net [get_bd_pins IR_transmission_22/ir_out] [get_bd_ports ir_out_21]
connect_bd_net [get_bd_pins IR_transmission_23/ir_out] [get_bd_ports ir_out_22]
connect_bd_net [get_bd_pins IR_transmission_24/ir_out] [get_bd_ports ir_out_23]

# ---- address map ----
assign_bd_address -offset 0x41200000 -range 64K -target_address_space [get_bd_addr_spaces processing_system7_0/Data] [get_bd_addr_segs axi_gpio_0/S_AXI/Reg]
assign_bd_address -offset 0x41210000 -range 64K -target_address_space [get_bd_addr_spaces processing_system7_0/Data] [get_bd_addr_segs axi_gpio_1/S_AXI/Reg]
assign_bd_address -offset 0x41220000 -range 64K -target_address_space [get_bd_addr_spaces processing_system7_0/Data] [get_bd_addr_segs axi_gpio_2/S_AXI/Reg]
assign_bd_address -offset 0x41230000 -range 64K -target_address_space [get_bd_addr_spaces processing_system7_0/Data] [get_bd_addr_segs axi_gpio_3/S_AXI/Reg]
assign_bd_address -offset 0x41240000 -range 64K -target_address_space [get_bd_addr_spaces processing_system7_0/Data] [get_bd_addr_segs axi_gpio_4/S_AXI/Reg]
assign_bd_address -offset 0x41250000 -range 64K -target_address_space [get_bd_addr_spaces processing_system7_0/Data] [get_bd_addr_segs axi_gpio_5/S_AXI/Reg]
assign_bd_address -offset 0x41260000 -range 64K -target_address_space [get_bd_addr_spaces processing_system7_0/Data] [get_bd_addr_segs axi_gpio_6/S_AXI/Reg]
assign_bd_address -offset 0x41270000 -range 64K -target_address_space [get_bd_addr_spaces processing_system7_0/Data] [get_bd_addr_segs axi_gpio_7/S_AXI/Reg]
assign_bd_address -offset 0x41280000 -range 64K -target_address_space [get_bd_addr_spaces processing_system7_0/Data] [get_bd_addr_segs axi_gpio_8/S_AXI/Reg]
assign_bd_address -offset 0x41290000 -range 64K -target_address_space [get_bd_addr_spaces processing_system7_0/Data] [get_bd_addr_segs axi_gpio_9/S_AXI/Reg]
assign_bd_address -offset 0x412A0000 -range 64K -target_address_space [get_bd_addr_spaces processing_system7_0/Data] [get_bd_addr_segs axi_gpio_10/S_AXI/Reg]
assign_bd_address -offset 0x412B0000 -range 64K -target_address_space [get_bd_addr_spaces processing_system7_0/Data] [get_bd_addr_segs axi_gpio_11/S_AXI/Reg]
assign_bd_address -offset 0x412C0000 -range 64K -target_address_space [get_bd_addr_spaces processing_system7_0/Data] [get_bd_addr_segs axi_gpio_12/S_AXI/Reg]
assign_bd_address -offset 0x412D0000 -range 64K -target_address_space [get_bd_addr_spaces processing_system7_0/Data] [get_bd_addr_segs axi_gpio_13/S_AXI/Reg]
assign_bd_address -offset 0x412E0000 -range 64K -target_address_space [get_bd_addr_spaces processing_system7_0/Data] [get_bd_addr_segs axi_gpio_14/S_AXI/Reg]
assign_bd_address -offset 0x412F0000 -range 64K -target_address_space [get_bd_addr_spaces processing_system7_0/Data] [get_bd_addr_segs axi_gpio_15/S_AXI/Reg]
assign_bd_address -offset 0x41300000 -range 64K -target_address_space [get_bd_addr_spaces processing_system7_0/Data] [get_bd_addr_segs axi_gpio_16/S_AXI/Reg]
assign_bd_address -offset 0x41310000 -range 64K -target_address_space [get_bd_addr_spaces processing_system7_0/Data] [get_bd_addr_segs axi_gpio_17/S_AXI/Reg]
assign_bd_address -offset 0x41320000 -range 64K -target_address_space [get_bd_addr_spaces processing_system7_0/Data] [get_bd_addr_segs axi_gpio_18/S_AXI/Reg]
assign_bd_address -offset 0x41330000 -range 64K -target_address_space [get_bd_addr_spaces processing_system7_0/Data] [get_bd_addr_segs axi_gpio_19/S_AXI/Reg]
assign_bd_address -offset 0x41340000 -range 64K -target_address_space [get_bd_addr_spaces processing_system7_0/Data] [get_bd_addr_segs axi_gpio_20/S_AXI/Reg]
assign_bd_address -offset 0x41350000 -range 64K -target_address_space [get_bd_addr_spaces processing_system7_0/Data] [get_bd_addr_segs axi_gpio_21/S_AXI/Reg]
assign_bd_address -offset 0x41360000 -range 64K -target_address_space [get_bd_addr_spaces processing_system7_0/Data] [get_bd_addr_segs axi_gpio_22/S_AXI/Reg]
assign_bd_address -offset 0x41370000 -range 64K -target_address_space [get_bd_addr_spaces processing_system7_0/Data] [get_bd_addr_segs axi_gpio_23/S_AXI/Reg]
assign_bd_address -offset 0x41380000 -range 64K -target_address_space [get_bd_addr_spaces processing_system7_0/Data] [get_bd_addr_segs axi_gpio_24/S_AXI/Reg]

validate_bd_design
save_bd_design
